# EAGLE design UART-Adapter (EAGLE 9.6.2)
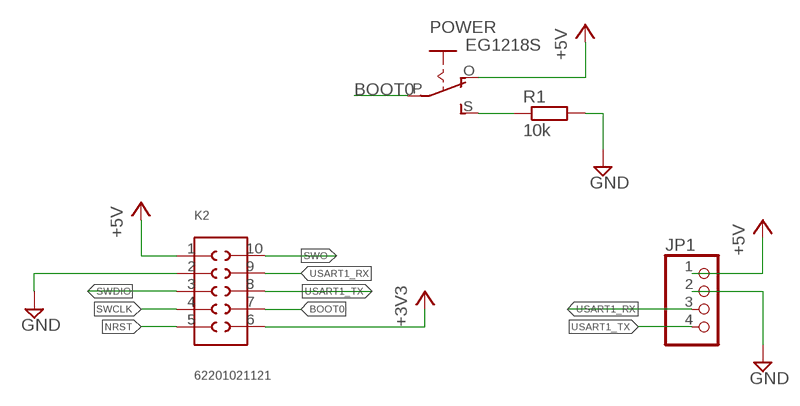
[diagram p0: schematic, sheet 1]

## Parts
JP1  PINHD-1X4  [1X04]
K2  62201021121  [62201021121]
POWER  EG1218S  [EG1218]
R1  10k  R-EU_R0603  [R0603]

## Nets
+3V3 [power]: K2.6
+5V [power]: JP1.1 K2.1 POWER.O
BOOT0: K2.7 POWER.P
GND [motor]: JP1.2 K2.2 R1.2
N$1: POWER.S R1.1
NRST: K2.5
SWCLK: K2.4
SWDIO: K2.3
SWO: K2.10
USART1_RX: JP1.3 K2.9
USART1_TX: JP1.4 K2.8

## Library data of the parts
JP1 = pinhead:PINHD-1X4: PIN HEADER
K2 = pinheader_1m27:62201021121: WR-PHD 1.27mm Dual Pin Header, 10 Pins=>Code : Con_BTB_PHD_1.27_2_62201021121 <http://katalog.we-online.de/media/thumbs2/eican/thb_Con_BTB_PHD_1.27_2_6220xx21121_pf2.jpg> Details see: http://katalog.we-online.de/en/em/622_0xx_211_21 Created 2014-06-03, Karrer Zheng 2014 (C) Würth Elektronik
POWER = EG1218:EG1218: SLIDING SWITCH 0.1" spacing through hole, vertical SPDT slide switch http://www.ladyada.net/library/pcb/eaglelibrary.html Check availability <https://pricing.snapeda.com/parts/EG1218/E-Switch/view-part?ref=eda>; AVAILABILITY: In Stock; DESCRIPTION: Slide Switch SPDT Through Hole; MF: E-Switch; MP: EG1218; PACKAGE: None; PRICE: None; PURCHASE-URL: https://pricing.snapeda.com/search/part/EG1218/?ref=eda
R1 = rcl:R-EU_: RESISTOR, European symbol; SPICEPREFIX: R

## Net classes
1 power: width 0.152 mm
2 motor: width 0.152 mm

## Board
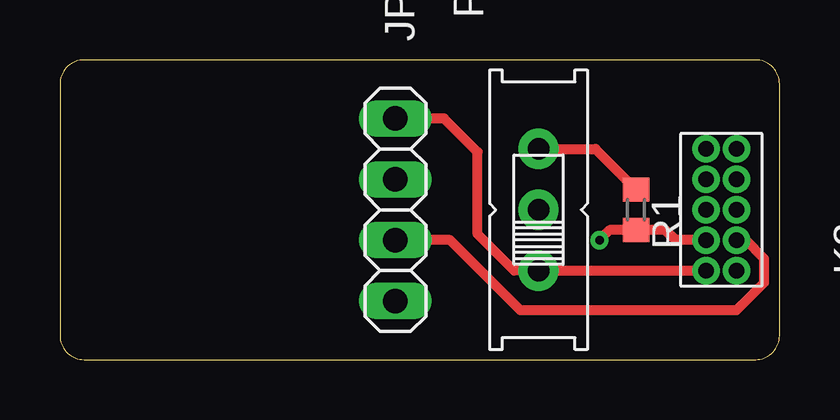
[diagram p1: board, top side]
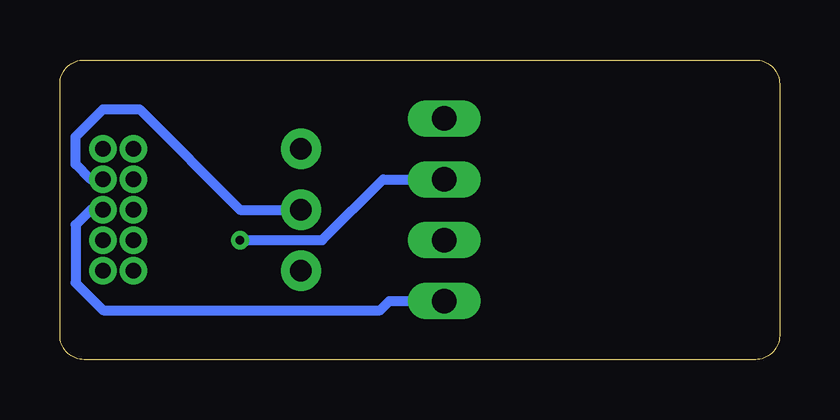
[diagram p2: board, bottom side, seen from below]

Size 30 x 12.5 mm. Coordinates in mm from the lower left corner, seen from the top.
Outline: 30,1 30,11.5 arc90 29,12.5 1,12.5 arc90 0,11.5 0,1 arc90 1,0 29,0 arc90 30,1
Copper layers (1*16): Top 0.035mm / dielectric 1.5mm / Bottom 0.035mm
Design rules "default *": minimum track width 6mil, minimum drill 0.35mm, track to track 6mil, track to pad 6mil, pad to pad 6mil, via to via 6mil, smd to smd 6mil, copper to edge 10mil, drill to drill 2mil, minimum pad ring 10mil, minimum via ring 8mil, stop-mask expansion 4mil, vias tented up to drill 10mil, thermal gap 10mil

### Footprints (pad centres in the part's own frame; a part is rotated, then mirrored left to right if it is on the bottom)
1X04 = drill 1.016 long: 1 -3.81,0; 2 -1.27,0; 3 1.27,0; 4 3.81,0
62201021121 = drill 0.65: 1 -2.54,0.635; 2 -1.27,0.635; 3 0,0.635; 4 1.27,0.635; 5 2.54,0.635; 6 2.54,-0.635; 7 1.27,-0.635; 8 0,-0.635; 9 -1.27,-0.635; 10 -2.54,-0.635
EG1218 = drill 0.9 pad 1.676: O -2.54,0; P 0,0; S 2.54,0
R0603 = smd 1 x 1.1: 1 -0.85,0; 2 0.85,0

### Placement (x,y rotation side)
JP1  13.98,6.25 270 top
K2  27.57,6.25 90 top
POWER  19.95,6.25 90 top
R1  24.02,6.25 270 top

### Tracks (layer width: path | path; a pad name or v marks a point on that pad's centre or on a via)
+5V
  Top 0.406: K2.1 POWER.O 18.94,3.71 17.41,5.23 17.41,8.66 16.02,10.06 JP1.1
BOOT0
  Bottom 0.406: K2.7 28.72,7.52 29.35,8.15 29.35,9.3 28.21,10.44 26.68,10.44 22.49,6.25 POWER.P
GND  (via drill 0.35)
  Top 0.406: K2.2 25.67,4.98 25.25,5.4 R1.2 22.91,5.4 v22.49,4.98
  Bottom 0.406: v22.49,4.98 19.06,4.98 16.52,7.52 JP1.2
N$1
  Top 0.406: POWER.S 22.33,8.79 R1.1
USART1_RX
  Top 0.406: K2.9 28.59,4.98 29.35,4.22 29.35,3.2 28.21,2.06 19.19,2.06 16.27,4.98 JP1.3
USART1_TX
  Bottom 0.406: K2.8 28.72,6.25 29.35,5.62 29.35,3.2 28.21,2.06 16.65,2.06 16.27,2.44 JP1.4

### Text on the board
tTest: RUN | BOOT